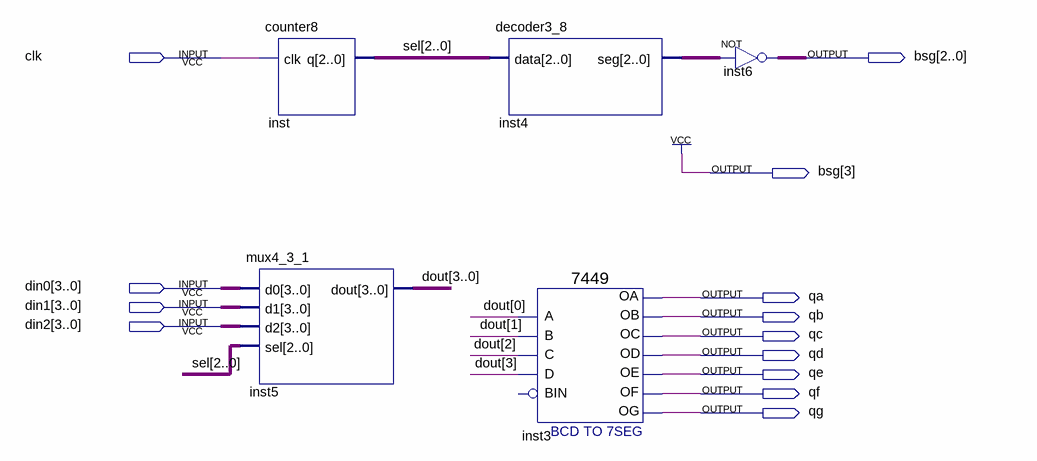
[diagram p0: schematic sheet]
// Quartus schematic scan_led3.bdf as structural Verilog: 5 symbols, 13 pins
module scan_led3 (
  input  clk,
  input  [3:0] din0,
  input  [3:0] din1,
  input  [3:0] din2,
  output [3:0] bsg,
  output qa,
  output qb,
  output qc,
  output qd,
  output qe,
  output qf,
  output qg
);

  wire [2:0] inst4_seg, sel;
  wire [3:0] dout;

  counter8 inst (.clk(clk), .q(sel));
  mux4_3_1 inst5 (.d0(din0), .d1(din1), .d2(din2), .sel(sel), .dout(dout));
  decoder3_8 inst4 (.data(sel), .seg(inst4_seg));
  \7449  inst3 (
    .A(dout[0]), .C(dout[2]), .B(dout[1]), .D(dout[3]), .OC(qc), .OD(qd), .OF(qf), .OG(qg), .OB(qb), .OA(qa),
    .OE(qe));  // open: BIN
  assign bsg[2:0] = ~inst4_seg;  // NOT inst6, 3 bits wide

  assign bsg[3] = 1'b1;
endmodule
